# Altium schematic sheet MEMS Motion Sensor.SchDoc
size 420 x 297 mm; Date: 22.03.2024; ApprovedBy: Arda B.; CheckedBy: Arda B.; DrawnBy: Arda Bozkurt; Revision: 001; SheetNumber: 8; SheetTotal: 9; Size: A3; Department: HDD; DOC_NO_ASSY_: __; Time: 22.03.2024
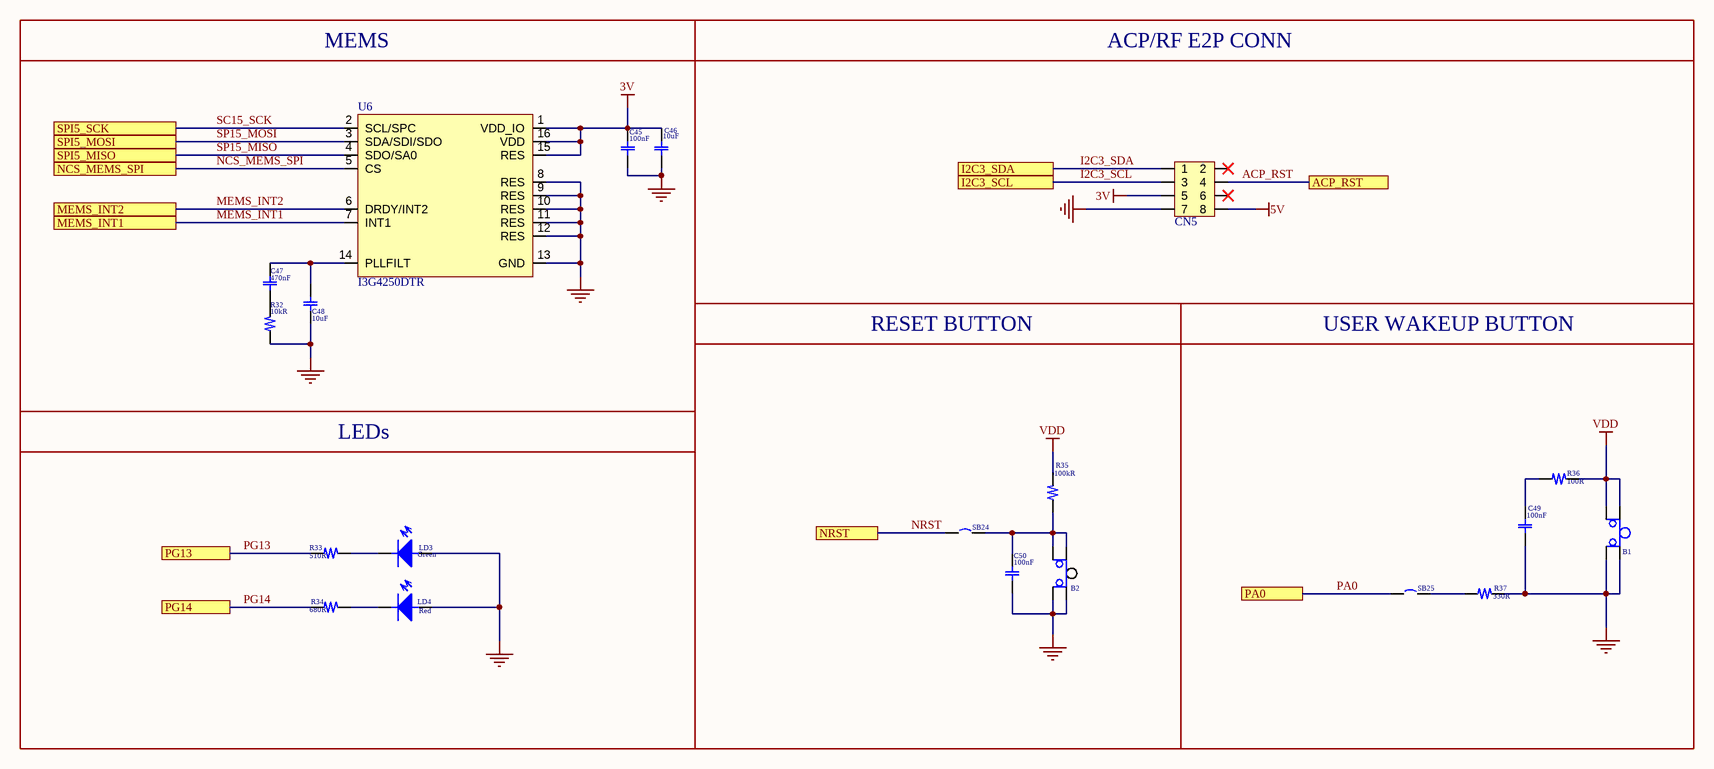
[diagram p0: MEMS Motion Sensor.SchDoc]

## Parts
B1  KSC721G LFS  [Blue_Button]  (value not drawn)
B2  KSC321GLFS  [Black_Buttom]  (value not drawn)
C45  value 100nF  [CAP-0402]  (hidden comment: CC0402KRX7R7BB104)
C46  value 10uF  [CAP-0603]  (hidden comment: CL10A106KP8NNNC)
C47  value 470nF  [CAP-0603]  (hidden comment: CC0603KRX7R7BB474)
C48  value 10uF  [CAP-0603]  (hidden comment: CL10A106KP8NNNC)
C49  value 100nF  [CAP-0402]  (hidden comment: CC0402KRX7R7BB104)
C50  value 100nF  [CAP-0402]  (hidden comment: CC0402KRX7R7BB104)
CN5  SSM-104-L-DH  [CONN-2*8]  (value not drawn)
LD3  Color: Green  [LED-GREEN-0603]  (hidden comment: 150060VS75000)
LD4  Color: Red  [LED-RED-0603]  (hidden comment: 150060RS75000)
R32  value 10kR  [RES-0402]  (hidden comment: RC0402FR-0710KL)
R33  value 510R  [RES-0402]  (hidden comment: RC0402FR-07510KL)
R34  value 680R  [RES-0603]  (hidden comment: RC0603FR-07680RL)
R35  value 100kR  [RES-0402]  (hidden comment: RC0402FR-07100KL)
R36  value 100R  [RES-0402]  (hidden comment: RC0402FR-07100RL)
R37  value 330R  [RES-0402]  (hidden comment: RC0402FR-07330RL)
SB24  RC0402JR-070RL  [RES-0402]  (value not drawn)
SB25  RC0402JR-070RL  [RES-0402]  (value not drawn)
U6  I3G4250DTR  [LGA-16]

## Ports
ACP_RST (see TOP[4B], Micro Controller[5B]), I2C3_SCL (see TOP[4B], LCD[4B], Micro Controller[5B]), I2C3_SDA (see TOP[4B], LCD[4B], Micro Controller[5B]), MEMS_INT1 (see TOP[5B], Micro Controller[5C]), MEMS_INT2 (see TOP[5B], Micro Controller[5B]), NCS_MEMS_SPI (see TOP[5B], Micro Controller[5B]), NRST (see TOP[4B], LCD[1B], Micro Controller[2C]), PA0 (see TOP[4B], Micro Controller[4A]), PG13 (see TOP[5B], Micro Controller[4A]), PG14 (see TOP[4B], Micro Controller[4A]), SPI5_MISO (see TOP[5B], Micro Controller[5B]), SPI5_MOSI (see TOP[5B], Micro Controller[5B]), SPI5_SCK (see TOP[5B], Micro Controller[5B])

## Nets
3V: C45.2 C46.2 CN5.5 U6.1(VDD_IO) U6.15(RES) U6.16(VDD)
5V: CN5.8
GND: B1.2 B1.3 B2.2 B2.3 C45.1 C46.1 C48.1 C49.1 C50.1 CN5.7 LD3.2 LD4.2 R32.1 R37.2 U6.8(RES) U6.9(RES) U6.10(RES) U6.11(RES) U6.12(RES) U6.13(GND)
VDD: B1.1 B1.4 R35.2 R36.2
ACP_RST: CN5.4 ; port ACP_RST
I2C3_SCL: CN5.3 ; port I2C3_SCL
I2C3_SDA: CN5.1 ; port I2C3_SDA
MEMS_INT1: U6.7(INT1) ; port MEMS_INT1
MEMS_INT2: U6.6(DRDY/INT2) ; port MEMS_INT2
NCS_MEMS_SPI: U6.5(CS) ; port NCS_MEMS_SPI
NRST: SB24.1 ; port NRST
PA0: SB25.1 ; port PA0
PG13: R33.1 ; port PG13
PG14: R34.1 ; port PG14
SC15_SCK: U6.2(SCL/SPC) ; port SPI5_SCK
SP15_MISO: U6.4(SDO/SA0) ; port SPI5_MISO
SP15_MOSI: U6.3(SDA/SDI/SDO) ; port SPI5_MOSI
NetB2_1: B2.1 B2.4 C50.2 R35.1 SB24.2
NetC47_1: C47.1 R32.2
NetC47_2: C47.2 C48.2 U6.14(PLLFILT)
NetC49_2: C49.2 R36.1
NetLD3_1: LD3.1 R33.2
NetLD4_1: LD4.1 R34.2
NetR37_1: R37.1 SB25.2

Not connected (* = marked no-connect by the designer): CN5 2* 6*

## Notes on the sheet
- MEMS
- ACP/RF E2P CONN
- RESET BUTTON
- USER WAKEUP BUTTON
- LEDs
- REVİSİON
- DESCRIPTION
- DATE
- APPROVED
- DWG NO:
- TAINIM/DESCRIPTION
- REV:
- DOSYA ADI/FİLE NAME
- HAZIRLAYAN/PREPARED BY
- KONTROL EDEN/ CHECKED BY
- YAYIN TARİHİ/REL. DATE
- DEĞ TARİHİ/CHANCE DATE
- ONAYLAYAN/APPROVED BY
- REVİZYON/REVISION
- Arda Bozkurt
- BÖLÜM/DEPARTMENT
- BOYUT/SİZE
- SAYFA/SHEET
- of

## Library data of the parts
B1 = BLUE SWITCH TACTILE: Switch Tactile N.O. SPST Round Button Gull Wing 0.05A 32VDC 1VA 300000Cycle 1.7N SMD T/R; Manufacturer: ITT C&K; Supplier: Farnell; Supplier Part Number: 3464289; Manufacturer Part Number: KSC721GLFS; RoHS: Yes; Stock: 488; Pricing: 1=0,63, 10=0,59, 25=0,57, 50=0,54, 100=0,52, 250=0,47 (EUR); ComponentLink1URL: https://datasheet.ciiva.com/2900/ksc-2900329.pdf?src-supplier=Digikey; ComponentLink1Description: https://datasheet.ciiva.com/2900/ksc-2900329.pdf?src-supplier=Digikey; ComponentLink2URL: https://datasheet.ciiva.com/2900/ksc-2900330.pdf?src-supplier=Digikey; ComponentLink2Description: https://datasheet.ciiva.com/2900/ksc-2900330.pdf?src-supplier=Digikey; ComponentLink3URL: https://datasheet.ciiva.com/2900/ksc-2900331.pdf?src-supplier=Digikey; ComponentLink3Description: https://datasheet.ciiva.com/2900/ksc-2900331.pdf?src-supplier=Digikey; Color: B
B2 = BLACK SWITCH TACTILE: Switch Tactile N.O. SPST Round Button Gull Wing 0.05A 32VDC 1VA 300000Cycles 1.7N SMD Automotive T/R; Manufacturer: ITT C&K; Supplier: Future Electronics; Supplier Part Number: 6485577; Manufacturer Part Number: KSC321GLFS; RoHS: Yes; Category: Tactile Switches; Stock: 10000; Pricing: 2000=0,28 (USD); ComponentLink1URL: https://datasheet.ciiva.com/26903/getdatasheetpartid-80827-26903733.pdf?src-supplier=Verical; ComponentLink1Description: https://datasheet.ciiva.com/26903/getdatasheetpartid-80827-26903733.pdf?src-supplier=Verical; ComponentLink2URL: https://datasheet.ciiva.com/16223/ksc321g20lfs-16223899.pdf?src-supplier=Future+Electronics; ComponentLink2Description: https://datasheet.ciiva.com/16223/ksc321g20lfs-16223899.pdf?src-supplier=Future+Electronics; ComponentLink3URL: https://datasheet.ciiva.com/30466/0900766b8129ca31-30466704.pdf?src-supplier=Rs; ComponentLink3Description: https://datasheet.ciiva.com/30466/0900766b8129ca31-30466704.pdf?src-supplier=Rs; ComponentLink4URL: https://datasheet.ciiva.com/2900/ksc-2900204.pdf?src-supplier=Digikey; ComponentLink4Description: https://datasheet.ciiva.com/2900/ksc-2900204.pdf?src-supplier=Digikey; ComponentLink5URL: https://datasheet.ciiva.com/2900/ksc-2900205.pdf?src-supplier=Digikey; ComponentLink5Description: https://datasheet.ciiva.com/2900/ksc-2900205.pdf?src-supplier=Digikey; ComponentLink6URL: https://datasheet.ciiva.com/2900/ksc-2900206.pdf?src-supplier=Digikey; ComponentLink6Description: https://datasheet.ciiva.com/2900/ksc-2900206.pdf?src-supplier=Digikey; ComponentLink7URL: https://datasheet.ciiva.com/16155/ksc-11mar10-16155558.pdf?src-supplier=Onlinecomponents.com; ComponentLink7Description: https://datasheet.ciiva.com/16155/ksc-11mar10-16155558.pdf?src-supplier=Onlinecomponents.com; ComponentLink8URL: https://datasheet.ciiva.com/46381/1707722-46381951.pdf?src-supplier=Element14; ComponentLink8Description: https://datasheet.ciiva.com/46381/1707722-46381951.pdf?src-supplier=Element14; ComponentLink9URL: https://datasheet.ciiva.com/7987/320569-7987016.pdf?src-supplier=Element14; ComponentLink9Description: https://datasheet.ciiva.com/7987/320569-7987016.pdf?src-supplier=Element14; Color: Black
C45 C49 C50 = CAP CER 100nF 16V X7R 0402: Multilayer Ceramic Capacitor, 0.1 uF, 25 V, ± 10%, X7R, 0402 [1005 Metric]; Manufacturer: Yageo; Material: 4241ConductorMaterial; Voltage Rating: 16V; Temperature Coefficient: 30ppm/°C; Supplier: Future Electronics; Supplier Part Number: 8517856; Manufacturer Part Number: CC0402KRX7R7BB104; RoHS: Yes; Category: Ceramic Capacitors; Stock: 30330000; Pricing: 10000=0,0028, 40000=0,0027, 150000=0,0025, 300000=0,0025, 750000=0,0023 (USD); Mounting Technology: Surface Mount; Case/Package: 0402; Pins: 2; Case Code (Metric): 1005; Case Code (Imperial): 0402; Min Operating Temperature: -55°C; Max Operating Temperature: 125°C; Tolerance: 10%; Dielectric: X7R; Voltage Rating (DC): 16V; Packaging: Tape and Reel; Package Quantity: 1; Termination: SMD/SMT; Voltage: 16V; Series: CC; Voltage Rating (AC): 16V; Length: 1mm; Width: 0.02inch; Height: 0.5mm; Thickness: 0.022inch; Depth: 0.5mm; Radiation Hardening: No; RoHS Compliant: Yes; Reach SVHC Compliant: No; Halogen Free: 5694HalogenFree; Lead Free: 5697LeadFree; ComponentLink1URL: https://datasheet.ciiva.com/11788/0900766b80ce67ed-11788364.pdf?src-supplier=Rs; ComponentLink1Description: https://datasheet.ciiva.com/11788/0900766b80ce67ed-11788364.pdf?src-supplier=Rs; ComponentLink2URL: https://datasheet.ciiva.com/7978/1489800-7978111.pdf?src-supplier=Element14; ComponentLink2Description: https://datasheet.ciiva.com/7978/1489800-7978111.pdf?src-supplier=Element14; ComponentLink3URL: https://datasheet.ciiva.com/161/mlccorderingcode-161545.pdf?src-supplier=Digikey; ComponentLink3Description: https://datasheet.ciiva.com/161/mlccorderingcode-161545.pdf?src-supplier=Digikey; ComponentLink4URL: https://datasheet.ciiva.com/161/mlccorderingcode-161544.pdf?src-supplier=Digikey; ComponentLink4Description: https://datasheet.ciiva.com/161/mlccorderingcode-161544.pdf?src-supplier=Digikey; ComponentLink5URL: https://datasheet.ciiva.com/161/mlccorderingcode-161546.pdf?src-supplier=Digikey; ComponentLink5Description: https://datasheet.ciiva.com/161/mlccorderingcode-161546.pdf?src-supplier=Digikey; ComponentLink6URL: https://datasheet.ciiva.com/8033/1734573-8033661.pdf?src-supplier=Element14; ComponentLink6Description: https://datasheet.ciiva.com/8033/1734573-8033661.pdf?src-supplier=Element14; ComponentLink7URL: https://datasheet.ciiva.com/11587/upy-gphc-x7r-6-3v-to-50v-8-11587305.pdf?src-supplier=Avnet; ComponentLink7Description: https://datasheet.ciiva.com/11587/upy-gphc-x7r-6-3v-to-50v-8-11587305.pdf?src-supplier=Avnet; ComponentLink8URL: https://datasheet.ciiva.com/28450/1489800-28450335.pdf?src-supplier=Element14; ComponentLink8Description: https://datasheet.ciiva.com/28450/1489800-28450335.pdf?src-supplier=Element14; ComponentLink9URL: https://datasheet.ciiva.com/13395/upy-gphc-x7r-6-3v-to-50v-8-13395676.pdf?src-supplier=Mouser; ComponentLink9Description: https://datasheet.ciiva.com/13395/upy-gphc-x7r-6-3v-to-50v-8-13395676.pdf?src-supplier=Mouser; ComponentLink10URL: https://datasheet.ciiva.com/8033/1734573-8033663.pdf?src-supplier=Element14; ComponentLink10Description: https://datasheet.ciiva.com/8033/1734573-8033663.pdf?src-supplier=Element14
C46 C48 = CAP CER 10UF 10V X5R 0603: Multilayer Ceramic Capacitor, 10 uF, 10 V, ± 10%, X5R, 0603 [1608 Metric]; Manufacturer: Samsung; Voltage Rating: 10V; Supplier: Avnet; Supplier Part Number: CL10A106KP8NNNC; Manufacturer Part Number: CL10A106KP8NNNC; RoHS: Yes; Category: Ceramic Capacitors; Stock: 204000; Pricing: 4000=0,02306, 8000=0,02253, 16000=0,022, 24000=0,02147, 32000=0,02094 (USD); Mounting Technology: Surface Mount; Case/Package: 0603; Case Code (Metric): 1608; Case Code (Imperial): 0603; Material: Ceramic; Min Operating Temperature: -55°C; Max Operating Temperature: 85°C; Tolerance: 10%; Dielectric: X5R; Package Quantity: 1; Packaging: Tape and Reel; Voltage Rating (DC): 10V; Series: CL; Construction: Flat; Length: 1.6mm; Width: 0.031inch; Height: 0.8mm; Thickness: 0.035inch; Depth: 0.8mm; Radiation Hardening: No; Lead Free: Lead Free; RoHS Compliant: Yes; ComponentLink1URL: https://datasheet.ciiva.com/26877/getdatasheetpartid-359551-26877881.pdf?src-supplier=Verical; ComponentLink1Description: https://datasheet.ciiva.com/26877/getdatasheetpartid-359551-26877881.pdf?src-supplier=Verical; ComponentLink2URL: https://datasheet.ciiva.com/29198/457369-da-01-en-vs-kondensator-0603-29198790.pdf?src-supplier=Conrad; ComponentLink2Description: https://datasheet.ciiva.com/29198/457369-da-01-en-vs-kondensator-0603-29198790.pdf?src-supplier=Conrad; ComponentLink3URL: https://datasheet.ciiva.com/16200/cl05b104kq5nnnc-16200766.pdf?src-supplier=Future+Electronics; ComponentLink3Description: https://datasheet.ciiva.com/16200/cl05b104kq5nnnc-16200766.pdf?src-supplier=Future+Electronics
C47 = CAP CER 470nF 16V X7R 0603: Multilayer Ceramic Capacitor, 0.47 uF, 16 V, ± 10%, X7R, 0603 [1608 Metric]; Manufacturer: Yageo; Material: 4241ConductorMaterial; Supplier: Future Electronics; Supplier Part Number: 6653356; Manufacturer Part Number: CC0603KRX7R7BB474; RoHS: Yes; Category: Ceramic Capacitors; Stock: 68000; Pricing: 4000=0,0144, 12000=0,0139, 20000=0,0137, 80000=0,0131, 120000=0,0127 (USD); ComponentLink1URL: https://datasheet.ciiva.com/26862/getdatasheetpartid-403574-26862831.pdf?src-supplier=Verical; ComponentLink1Description: https://datasheet.ciiva.com/26862/getdatasheetpartid-403574-26862831.pdf?src-supplier=Verical; ComponentLink2URL: https://datasheet.ciiva.com/176/mlccorderingcode-176901.pdf?src-supplier=Digikey; ComponentLink2Description: https://datasheet.ciiva.com/176/mlccorderingcode-176901.pdf?src-supplier=Digikey; ComponentLink3URL: https://datasheet.ciiva.com/176/mlccorderingcode-176902.pdf?src-supplier=Digikey; ComponentLink3Description: https://datasheet.ciiva.com/176/mlccorderingcode-176902.pdf?src-supplier=Digikey; ComponentLink4URL: https://datasheet.ciiva.com/176/mlccorderingcode-176903.pdf?src-supplier=Digikey; ComponentLink4Description: https://datasheet.ciiva.com/176/mlccorderingcode-176903.pdf?src-supplier=Digikey; ComponentLink5URL: https://datasheet.ciiva.com/28450/1489800-28450569.pdf?src-supplier=Element14; ComponentLink5Description: https://datasheet.ciiva.com/28450/1489800-28450569.pdf?src-supplier=Element14
CN5 = CONN 2*8POS 2.54MM: Connector Socket Strip SKT 8 POS 2.54mm Solder RA SMD; Manufacturer: Samtec; Supplier: Mouser; Supplier Part Number: 200-SSM104LDH; Manufacturer Part Number: SSM-104-L-DH; RoHS: Yes; Category: Connectors; Stock: 39; Pricing: 1=3,24, 10=3,24, 50=3,24, 100=3,24, 1000=1,99, 10000=1,12 (USD); ComponentLink1URL: https://datasheet.ciiva.com/25617/0900766b81159465-25617452.pdf?src-supplier=Rs; ComponentLink1Description: https://datasheet.ciiva.com/25617/0900766b81159465-25617452.pdf?src-supplier=Rs; ComponentLink2URL: https://datasheet.ciiva.com/746/ssm-1xx-xxx-xx-xx-xx-x-xx-xx-mkt-746592.pdf?src-supplier=Digikey; ComponentLink2Description: https://datasheet.ciiva.com/746/ssm-1xx-xxx-xx-xx-xx-x-xx-xx-mkt-746592.pdf?src-supplier=Digikey
LD3 = LED GREEN CLEAR 0603 SMD: WURTH ELEKTRONIK - 150060VS75000 - LED, Green, SMD, 0603, 30 mA, 2 V, 570 nm; Manufacturer: Wurth Electronics; Lens Color: Colorless; Luminous Intensity: 40mcd; Viewing Angle: 140°; Forward Voltage: 2V; Lens Style: Rectangular,Flat; Forward Current: 20mA; Dominant Wavelength: 570nm; Lens Transparency: Clear; Power Rating: 72mW; Reverse Voltage (DC): 5V; Lens Size: 0.7mm; Supplier: Farnell; Supplier Part Number: 2322073; Manufacturer Part Number: 150060VS75000; RoHS: Yes; Category: LEDs; Stock: 2968; Pricing: 5=0,164, 10=0,147, 100=0,121, 500=0,11, 1000=0,108 (EUR); Mounting Technology: Surface Mount; Case/Package: 0603; Pins: 2; Case Code (Metric): 1608; Case Code (Imperial): 0603; Weight: 0.000882oz; Min Operating Temperature: -40°C; Max Operating Temperature: 85°C; Package Quantity: 4000; Packaging: Cut Tape; Test Current: 20mA; Illumination Color: Green; Series: WL-SMCW; Max Reverse Voltage (DC): 5V; Power Dissipation: 72mW; Reverse Voltage: 5V; Length: 1.6mm; Width: 0.8mm; Height: 0.8mm; RoHS Compliant: Yes; Reach SVHC Compliant: 4187SVHC; ComponentLink1URL: https://datasheet.ciiva.com/29562/150060vs75000-29562919.pdf?src-supplier=Digikey; ComponentLink1Description: https://datasheet.ciiva.com/29562/150060vs75000-29562919.pdf?src-supplier=Digikey
LD4 = LED RED CLEAR 0603 SMD: LED Low-Power Uni-Color Red 630nm 2V 2-Pin Chip 0603(1608Metric) T/R; Manufacturer: Wurth Electronics; Lens Color: Colorless; Viewing Angle: 140°; Lens Style: Clear,Flat,Rectangular; Luminous Intensity: 250mcd; Forward Current: 30mA; Wavelength: 625nm; Test Current: 20mA; Lens Transparency: Clear; Max Reverse Voltage (DC): 5V; Power Dissipation: 72mW; Lens Size: 0.7mm; Supplier: Farnell; Supplier Part Number: 2322071; Manufacturer Part Number: 150060RS75000; RoHS: Yes; Category: LEDs; Stock: 28909; Pricing: 5=0,164, 10=0,147, 100=0,121, 500=0,11, 1000=0,108 (EUR); Mounting Technology: Surface Mount; Case/Package: 0603; Case Code (Metric): 1608; Case Code (Imperial): 0603; Min Operating Temperature: -40°C; Max Operating Temperature: 85°C; Package Quantity: 1; Packaging: Cut Tape; Forward Voltage: 2V; Dominant Wavelength: 625nm; Series: WL-SMCW; Reverse Voltage: 5V; Length: 1.6mm; Width: 0.8mm; Height: 0.8mm; RoHS Compliant: Yes; Reach SVHC Compliant: Unknown; ComponentLink1URL: https://datasheet.ciiva.com/29563/150060rs75000-29563040.pdf?src-supplier=Digikey; ComponentLink1Description: https://datasheet.ciiva.com/29563/150060rs75000-29563040.pdf?src-supplier=Digikey; ComponentLink2URL: https://datasheet.ciiva.com/29279/759428-da-01-en-chipled-0603-w-kl-rot-150060rs75000-29279196.pdf?src-supplier=Conrad; ComponentLink2Description: https://datasheet.ciiva.com/29279/759428-da-01-en-chipled-0603-w-kl-rot-150060rs75000-29279196.pdf?src-supplier=Conrad
R32 = RES 10K OHM 1% 1/16W 0402: SMD Chip Resistor, 10 kOhm, ± 1%, 63 mW, 0402 [1005 Metric], Thick Film, General Purpose; Manufacturer: Yageo; Voltage Rating (DC): 50V; Temperature Coefficient: 100ppm/°C; Power Rating: 62.5mW; Max Power Dissipation: 63mW; Supplier: Future Electronics; Supplier Part Number: 3388022; Manufacturer Part Number: RC0402FR-0710KL; RoHS: Yes; Category: Chip SMD Resistors; Stock: 56000000; Pricing: 10000=0,0012, 100000=0,0011, 300000=0,001, 750000=0,001, 2000000=0,0009 (USD); Case/Package: 0402; Pins: 2; Case Code (Imperial): 0402; Case Code (Metric): 1005; Min Operating Temperature: -55°C; Max Operating Temperature: 155°C; Resistor Type: Thick Film; Voltage Rating: 50V; Tolerance: 1%; Packaging: Tape and Reel; Termination: SMD/SMT; Series: RC; Number of Terminations: 2; Features: Moisture Resistant; Resistance Tolerance: 1%; Construction: Rectangular; Length: 1mm; Width: 0.5mm; Depth: 0.5mm; Lead Pitch: 0.2mm; RoHS Compliant: Yes; Reach SVHC Compliant: Unknown; Lead Free: 5697LeadFree; Military Standard: Not; ComponentLink1URL: https://datasheet.ciiva.com/7660/38568-7660787.pdf?src-supplier=Element14; ComponentLink1Description: https://datasheet.ciiva.com/7660/38568-7660787.pdf?src-supplier=Element14; ComponentLink2URL: https://datasheet.ciiva.com/7849/1686128-7849814.pdf?src-supplier=Element14; ComponentLink2Description: https://datasheet.ciiva.com/7849/1686128-7849814.pdf?src-supplier=Element14; ComponentLink3URL: https://datasheet.ciiva.com/7983/1018594-7983486.pdf?src-supplier=Element14; ComponentLink3Description: https://datasheet.ciiva.com/7983/1018594-7983486.pdf?src-supplier=Element14
R33 = RES 510K OHM 1% 1/16W 0402: SMD Chip Resistor, 510 kOhm, ± 1%, 63 mW, 0402 [1005 Metric], Thick Film, General Purpose; Manufacturer: Yageo; Power Rating: 63mW; Voltage Rating: 50V; Temperature Coefficient: 100ppm/°C; Supplier: Future Electronics; Supplier Part Number: 2225407; Manufacturer Part Number: RC0402FR-07510KL; RoHS: Yes; Category: Chip SMD Resistors; Stock: 3670000; Pricing: 10000=0,0019, 100000=0,0011, 200000=0,0018, 300000=0,001, 750000=0,0017, 2000000=0,0017, 7500000=0,0015 (USD); Case/Package: 0402; Case Code (Imperial): 0402; Case Code (Metric): 1005; Min Operating Temperature: -55°C; Max Operating Temperature: 155°C; Tolerance: 1%; Packaging: Tape and Reel; Package Quantity: 1; Termination: SMD/SMT; Resistor Type: Thick Film; Number of Terminations: 2; Max Power Dissipation: 63mW; Features: Moisture Resistant; Series: RC; Construction: Rectangular; Resistance Tolerance: 1%; Technology: THICK FILM; Voltage Rating (DC): 50V; Length: 1mm; Width: 0.02inch; Height: 0.016inch; Depth: 0.5mm; Military Standard: Not; RoHS Compliant: Yes; Reach SVHC Compliant: Unknown; Lead Free: 5697LeadFree; ComponentLink1URL: https://datasheet.ciiva.com/11808/0900766b80c66297-11808810.pdf?src-supplier=Rs; ComponentLink1Description: https://datasheet.ciiva.com/11808/0900766b80c66297-11808810.pdf?src-supplier=Rs; ComponentLink2URL: https://datasheet.ciiva.com/2453/pyu-r-int-thick-7-2453464.pdf?src-supplier=Digikey; ComponentLink2Description: https://datasheet.ciiva.com/2453/pyu-r-int-thick-7-2453464.pdf?src-supplier=Digikey; ComponentLink3URL: https://datasheet.ciiva.com/2453/pyu-r-int-thick-7-2453463.pdf?src-supplier=Digikey; ComponentLink3Description: https://datasheet.ciiva.com/2453/pyu-r-int-thick-7-2453463.pdf?src-supplier=Digikey; ComponentLink4URL: https://datasheet.ciiva.com/17419/pyu-rc0402-51-rohs-l-6-r-17419596.pdf?src-supplier=Future+Electronics; ComponentLink4Description: https://datasheet.ciiva.com/17419/pyu-rc0402-51-rohs-l-6-r-17419596.pdf?src-supplier=Future+Electronics; ComponentLink5URL: https://datasheet.ciiva.com/2453/pyu-r-int-thick-7-2453465.pdf?src-supplier=Digikey; ComponentLink5Description: https://datasheet.ciiva.com/2453/pyu-r-int-thick-7-2453465.pdf?src-supplier=Digikey
R34 = RES 680 OHM 1% 1/10W 0603: SMD Chip Resistor, 680 Ohm, ± 1%, 100 mW, 0603 [1608 Metric], Thick Film, General Purpose; Manufacturer: Yageo; Voltage Rating (DC): 50V; Temperature Coefficient: 100ppm/°C; Power Rating: 100mW; Working Voltage: 75V; Supplier: Future Electronics; Supplier Part Number: 6789788; Manufacturer Part Number: RC0603FR-07680RL; RoHS: Yes; Category: Chip SMD Resistors; Stock: 2255000; Pricing: 5000=0,0032, 50000=0,0029, 100000=0,003, 150000=0,0028, 375000=0,0028, 1000000=0,0025, 1250000=0,0027, 5000000=0,0025 (USD); Case/Package: 0603; Pins: 2; Case Code (Imperial): 0603; Case Code (Metric): 1608; Min Operating Temperature: -55°C; Max Operating Temperature: 155°C; Tolerance: 1%; Resistor Type: Thick Film; Packaging: Tape and Reel; Number of Terminations: 2; Voltage Rating: 50V; Termination: SMD/SMT; Max Power Dissipation: 100mW; Features: Moisture Resistant; Series: RC; Resistance Tolerance: 1%; Construction: Rectangular; Voltage Rating (AC): 50V; Length: 1.6mm; Width: 0.8mm; Depth: 0.8mm; Reach SVHC Compliant: No; Lead Free: Lead Free; Military Standard: Not; RoHS Compliant: Yes; ComponentLink1URL: https://datasheet.ciiva.com/46412/443971-46412854.pdf?src-supplier=Element14; ComponentLink1Description: https://datasheet.ciiva.com/46412/443971-46412854.pdf?src-supplier=Element14; ComponentLink2URL: https://datasheet.ciiva.com/2553/pyu-r-int-thick-7-2553546.pdf?src-supplier=Digikey; ComponentLink2Description: https://datasheet.ciiva.com/2553/pyu-r-int-thick-7-2553546.pdf?src-supplier=Digikey; ComponentLink3URL: https://datasheet.ciiva.com/2553/pyu-r-int-thick-7-2553545.pdf?src-supplier=Digikey; ComponentLink3Description: https://datasheet.ciiva.com/2553/pyu-r-int-thick-7-2553545.pdf?src-supplier=Digikey; ComponentLink4URL: https://datasheet.ciiva.com/7746/443971-7746389.pdf?src-supplier=Element14; ComponentLink4Description: https://datasheet.ciiva.com/7746/443971-7746389.pdf?src-supplier=Element14; ComponentLink5URL: https://datasheet.ciiva.com/2553/pyu-r-int-thick-7-2553547.pdf?src-supplier=Digikey; ComponentLink5Description: https://datasheet.ciiva.com/2553/pyu-r-int-thick-7-2553547.pdf?src-supplier=Digikey
R35 = RES 100K OHM 1% 1/16W 0402: SMD Chip Resistor, 100 kOhm, ± 1%, 63 mW, 0402 [1005 Metric], Thick Film, General Purpose; Manufacturer: Yageo; Temperature Coefficient: 100ppm/°C; Power Rating: 63mW; Voltage Rating: 50V; Supplier: Future Electronics; Supplier Part Number: 6468466; Manufacturer Part Number: RC0402FR-07100KL; RoHS: Yes; Category: Chip SMD Resistors; Stock: 35770000; Pricing: 10000=0,0019, 100000=0,0018, 300000=0,0017, 750000=0,0016, 2000000=0,0015 (USD); Case/Package: 0402; Case Code (Metric): 1005; Case Code (Imperial): 0402; Min Operating Temperature: -55°C; Max Operating Temperature: 155°C; Resistor Type: Thick Film; Tolerance: 1%; Packaging: Tape and Reel; Package Quantity: 1; Number of Terminations: 2; Termination: SMD/SMT; Max Power Dissipation: 63mW; Features: Moisture Resistant; Series: RC; Resistance Tolerance: 1%; Construction: Rectangular; Technology: THICK FILM; Voltage Rating (AC): 50V; Length: 0.039inch; Width: 0.02inch; Height: 0.016inch; Depth: 0.5mm; Reach SVHC Compliant: No; RoHS Compliant: Yes; Lead Free: 5697LeadFree; Military Standard: Not; ComponentLink1URL: https://datasheet.ciiva.com/11819/0900766b80c66297-11819452.pdf?src-supplier=Rs; ComponentLink1Description: https://datasheet.ciiva.com/11819/0900766b80c66297-11819452.pdf?src-supplier=Rs; ComponentLink2URL: https://datasheet.ciiva.com/22747/1018594-22747509.pdf?src-supplier=Element14; ComponentLink2Description: https://datasheet.ciiva.com/22747/1018594-22747509.pdf?src-supplier=Element14; ComponentLink3URL: https://datasheet.ciiva.com/2453/pyu-r-int-thick-7-2453362.pdf?src-supplier=Digikey; ComponentLink3Description: https://datasheet.ciiva.com/2453/pyu-r-int-thick-7-2453362.pdf?src-supplier=Digikey; ComponentLink4URL: https://datasheet.ciiva.com/2453/pyu-r-int-thick-7-2453363.pdf?src-supplier=Digikey; ComponentLink4Description: https://datasheet.ciiva.com/2453/pyu-r-int-thick-7-2453363.pdf?src-supplier=Digikey; ComponentLink5URL: https://datasheet.ciiva.com/2453/pyu-r-int-thick-7-2453361.pdf?src-supplier=Digikey; ComponentLink5Description: https://datasheet.ciiva.com/2453/pyu-r-int-thick-7-2453361.pdf?src-supplier=Digikey; ComponentLink6URL: https://datasheet.ciiva.com/12667/pyu-rc0402-51-rohs-l-6-r-12667930.pdf?src-supplier=Mouser; ComponentLink6Description: https://datasheet.ciiva.com/12667/pyu-rc0402-51-rohs-l-6-r-12667930.pdf?src-supplier=Mouser; ComponentLink7URL: https://datasheet.ciiva.com/15189/getdatasheetpartid-323696-15189334.pdf?src-supplier=Verical; ComponentLink7Description: https://datasheet.ciiva.com/15189/getdatasheetpartid-323696-15189334.pdf?src-supplier=Verical
R36 = RES 100 OHM 1% 1/16W 0402: SMD Chip Resistor, 100 Ohm, ± 1%, 63 mW, 0402 [1005 Metric], Thick Film, General Purpose; Manufacturer: Yageo; Power Rating: 62.5mW; Voltage Rating: 50V; Temperature Coefficient: 100ppm/°C; Max Power Dissipation: 63mW; Supplier: Future Electronics; Supplier Part Number: 2266856; Manufacturer Part Number: RC0402FR-07100RL; RoHS: Yes; Category: Chip SMD Resistors; Stock: 3260000; Pricing: 10000=0,0021, 100000=0,002, 300000=0,0019, 750000=0,0019, 2000000=0,0017 (USD); Case/Package: 0402; Pins: 2; Case Code (Imperial): 0402; Case Code (Metric): 1005; Min Operating Temperature: -55°C; Max Operating Temperature: 155°C; Tolerance: 1%; Voltage Rating (DC): 50V; Packaging: Tape and Reel; Termination: SMD/SMT; Resistor Type: Thick Film; Features: Moisture Resistant; Series: RC; Number of Terminations: 2; Resistance Tolerance: 1%; Construction: Rectangular; Technology: THICK FILM; Length: 1mm; Width: 0.5mm; Height: 0.32mm; Depth: 0.5mm; RoHS Compliant: Yes; Reach SVHC Compliant: No; Military Standard: Not; Lead Free: Lead Free; ComponentLink1URL: https://datasheet.ciiva.com/7849/1784430-7849810.pdf?src-supplier=Element14; ComponentLink1Description: https://datasheet.ciiva.com/7849/1784430-7849810.pdf?src-supplier=Element14; ComponentLink2URL: https://datasheet.ciiva.com/11808/0900766b80c66297-11808765.pdf?src-supplier=Rs; ComponentLink2Description: https://datasheet.ciiva.com/11808/0900766b80c66297-11808765.pdf?src-supplier=Rs; ComponentLink3URL: https://datasheet.ciiva.com/28367/1018594-28367226.pdf?src-supplier=Element14; ComponentLink3Description: https://datasheet.ciiva.com/28367/1018594-28367226.pdf?src-supplier=Element14; ComponentLink4URL: https://datasheet.ciiva.com/22747/1018594-22747511.pdf?src-supplier=Element14; ComponentLink4Description: https://datasheet.ciiva.com/22747/1018594-22747511.pdf?src-supplier=Element14; ComponentLink5URL: https://datasheet.ciiva.com/12667/pyu-rc0402-51-rohs-l-6-r-12667957.pdf?src-supplier=Mouser; ComponentLink5Description: https://datasheet.ciiva.com/12667/pyu-rc0402-51-rohs-l-6-r-12667957.pdf?src-supplier=Mouser; ComponentLink6URL: https://datasheet.ciiva.com/16740/pyu-rc0402-51-rohs-l-6-r-16740566.pdf?src-supplier=Future+Electronics; ComponentLink6Description: https://datasheet.ciiva.com/16740/pyu-rc0402-51-rohs-l-6-r-16740566.pdf?src-supplier=Future+Electronics; ComponentLink7URL: https://datasheet.ciiva.com/15189/getdatasheetpartid-329466-15189335.pdf?src-supplier=Verical; ComponentLink7Description: https://datasheet.ciiva.com/15189/getdatasheetpartid-329466-15189335.pdf?src-supplier=Verical
R37 = RES 330 OHM 1% 1/16W 0402: SMD Chip Resistor, 330 Ohm, ± 1%, 63 mW, 0402 [1005 Metric], Thick Film, General Purpose; Manufacturer: Yageo; Temperature Coefficient: 100ppm/°C; Power Rating: 62.5mW; Voltage Rating: 50V; Max Power Dissipation: 63mW; Supplier: Future Electronics; Supplier Part Number: 7045693; Manufacturer Part Number: RC0402FR-07330RL; RoHS: Yes; Category: Chip SMD Resistors; Stock: 1480000; Pricing: 10000=0,002, 100000=0,0011, 200000=0,0019, 300000=0,001, 750000=0,0018, 2000000=0,0018, 7500000=0,0016 (USD); Case/Package: 0402; Case Code (Metric): 1005; Case Code (Imperial): 0402; Min Operating Temperature: -55°C; Max Operating Temperature: 155°C; Packaging: Tape and Reel; Tolerance: 1%; Package Quantity: 1; Resistor Type: Thick Film; Number of Terminations: 2; Termination: SMD/SMT; Features: Moisture Resistant; Series: RC; Construction: Rectangular; Technology: THICK FILM; Resistance Tolerance: 1%; Voltage Rating (AC): 50V; Length: 0.039inch; Width: 0.02inch; Height: 0.016inch; Depth: 0.5mm; RoHS Compliant: Yes; Reach SVHC Compliant: No; Military Standard: Not; Lead Free: 5697LeadFree; ComponentLink1URL: https://datasheet.ciiva.com/11819/0900766b80c66297-11819490.pdf?src-supplier=Rs; ComponentLink1Description: https://datasheet.ciiva.com/11819/0900766b80c66297-11819490.pdf?src-supplier=Rs; ComponentLink2URL: https://datasheet.ciiva.com/2453/pyu-r-int-thick-7-2453662.pdf?src-supplier=Digikey; ComponentLink2Description: https://datasheet.ciiva.com/2453/pyu-r-int-thick-7-2453662.pdf?src-supplier=Digikey; ComponentLink3URL: https://datasheet.ciiva.com/2453/pyu-r-int-thick-7-2453663.pdf?src-supplier=Digikey; ComponentLink3Description: https://datasheet.ciiva.com/2453/pyu-r-int-thick-7-2453663.pdf?src-supplier=Digikey; ComponentLink4URL: https://datasheet.ciiva.com/2453/pyu-r-int-thick-7-2453661.pdf?src-supplier=Digikey; ComponentLink4Description: https://datasheet.ciiva.com/2453/pyu-r-int-thick-7-2453661.pdf?src-supplier=Digikey; ComponentLink5URL: https://datasheet.ciiva.com/12656/pyu-rc0402-51-rohs-l-6-r-12656815.pdf?src-supplier=Mouser; ComponentLink5Description: https://datasheet.ciiva.com/12656/pyu-rc0402-51-rohs-l-6-r-12656815.pdf?src-supplier=Mouser; ComponentLink6URL: https://datasheet.ciiva.com/7849/1018594-7849963.pdf?src-supplier=Element14; ComponentLink6Description: https://datasheet.ciiva.com/7849/1018594-7849963.pdf?src-supplier=Element14; ComponentLink7URL: https://datasheet.ciiva.com/7849/1018594-7849962.pdf?src-supplier=Element14; ComponentLink7Description: https://datasheet.ciiva.com/7849/1018594-7849962.pdf?src-supplier=Element14; ComponentLink8URL: https://datasheet.ciiva.com/17083/pyu-rc0402-51-rohs-l-6-r-17083994.pdf?src-supplier=Future+Electronics; ComponentLink8Description: https://datasheet.ciiva.com/17083/pyu-rc0402-51-rohs-l-6-r-17083994.pdf?src-supplier=Future+Electronics
SB24 SB25 = RES 0 OHM JUMPER 1/10W 0603: Zero Ohm Resistor, Jumper, 0402 [1005 Metric], Thick Film, 62.5 mW, 1 A, Surface Mount; Manufacturer: Yageo; Manufacturer Part Number: RC0603JR-070RL; Tolerance: 1%; Power Rating: 100mW; Voltage Rating (DC): 50V; Temperature Coefficient: 200ppm/°C; Resistance Tolerance: 5%; Value: 0mR; Supplier: Future Electronics; Supplier Part Number: 3992146; RoHS: Yes; Category: Chip SMD Resistors; Stock: 16200000; Pricing: 5000=0,0016, 50000=0,0014, 100000=0,0015, 150000=0,0014, 375000=0,0014, 1000000=0,0012, 1250000=0,0013, 5000000=0,0012 (USD); Case/Package: 0603; Pins: 2; Contact Plating: Tin,Matte; Case Code (Imperial): 0402; Case Code (Metric): 1608; Min Operating Temperature: -55°C; Max Operating Temperature: 155°C; Resistor Type: Thick Film; Packaging: Tape and Reel; Termination: SMD/SMT; Series: RC; Technology: THICK FILM; Package Quantity: 5000; Voltage Rating: 50V; Features: Moisture Resistant; Max Power Dissipation: 100mW; Number of Terminations: 2; Construction: Rectangular; Length: 1.6mm; Width: 0.8mm; Height: 0.45mm; Depth: 0.8mm; RoHS Compliant: Yes; Reach SVHC Compliant: Unknown; Lead Free: 5697LeadFree; Military Standard: Not
U6 = MEMS MOTION SENSOR 3AXIS 16LGA: I3G4250D Series 3.6 V 6.1 mA Low-Power 3-Axis Angular Rate Sensor - LGA-16; Manufacturer: STMicroelectronics; Supplier: Mouser; Supplier Part Number: 511-I3G4250DTR; Manufacturer Part Number: I3G4250DTR; RoHS: Yes; Category: Gyroscopes; Stock: 11568; Pricing: 1=11,09, 10=8,21, 50=8,21, 100=7,03, 1000=6,15, 10000=5,95 (USD); ComponentLink1URL: http://www.farnell.com/datasheets/2028144.pdf?src-supplier=Farnell; ComponentLink1Description: http://www.farnell.com/datasheets/2028144.pdf?src-supplier=Farnell; ComponentLink2URL: http://www.st.com/st-web-ui/static/active/en/resource/technical/document/datasheet/DM00168691.pdf?src-supplier=Avnet; ComponentLink2Description: http://www.st.com/st-web-ui/static/active/en/resource/technical/document/datasheet/DM00168691.pdf?src-supplier=Avnet; ComponentLink3URL: http://www.farnell.com/datasheets/2028144.pdf?src-supplier=Element14; ComponentLink3Description: http://www.farnell.com/datasheets/2028144.pdf?src-supplier=Element14; ComponentLink4URL: http://www.st.com/content/ccc/resource/technical/document/datasheet/e4/b1/d1/62/1a/e6/44/2f/DM00168691.pdf/files/DM00168691.pdf/jcr:content/translations/en.DM00168691.pdf?src-supplier=Digikey; ComponentLink4Description: http://www.st.com/content/ccc/resource/technical/document/datasheet/e4/b1/d1/62/1a/e6/44/2f/DM00168691.pdf/files/DM00168691.pdf/jcr:content/translations/en.DM00168691.pdf?src-supplier=Digikey